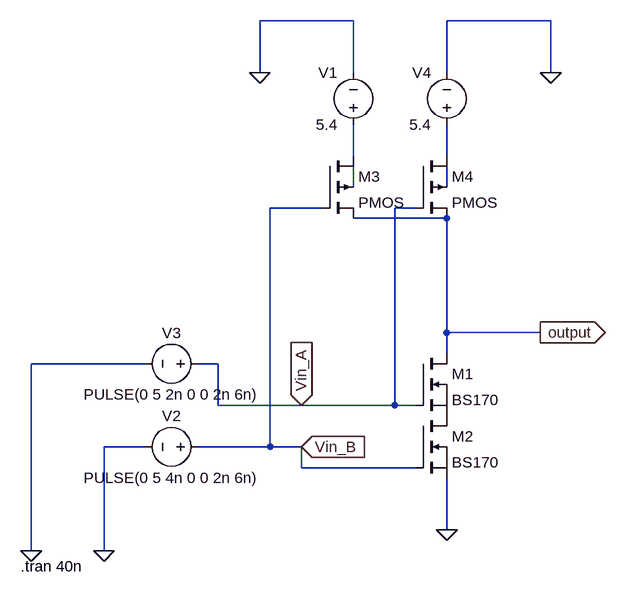
[diagram p0: schematic and_mos_v2.asc]
and_mos_v2.asc, the LTspice schematic file:
Version 4.1
SHEET 1 880 680
WIRE 80 -496 -64 -496
WIRE 384 -496 224 -496
WIRE -64 -416 -64 -496
WIRE 80 -416 80 -496
WIRE 224 -416 224 -496
WIRE 384 -416 384 -496
WIRE 80 -288 80 -336
WIRE 224 -288 224 -336
WIRE 80 -240 80 -272
WIRE 224 -240 224 -272
WIRE 32 -208 -48 -208
WIRE 176 -208 144 -208
WIRE 224 -192 80 -192
WIRE 224 -16 224 -192
WIRE 368 -16 224 -16
WIRE 224 16 224 -16
WIRE -240 32 -416 32
WIRE -128 32 -160 32
WIRE -128 96 -128 32
WIRE 0 96 -128 96
WIRE 144 96 144 -208
WIRE 144 96 0 96
WIRE 176 96 144 96
WIRE -240 160 -304 160
WIRE -48 160 -48 -208
WIRE -48 160 -160 160
WIRE 0 160 -48 160
WIRE 0 192 0 160
WIRE 176 192 0 192
WIRE 224 288 224 208
WIRE -416 320 -416 32
WIRE -304 320 -304 160
FLAG 0 96 Vin_A
IOPIN 0 96 In
FLAG 0 160 Vin_B
IOPIN 0 160 In
FLAG -304 320 0
FLAG -416 320 0
FLAG 224 288 0
FLAG 368 -16 output
IOPIN 368 -16 Out
FLAG -64 -416 0
FLAG 384 -416 0
SYMBOL voltage -144 160 R90
WINDOW 0 -32 56 VBottom 2
WINDOW 3 32 56 VTop 2
WINDOW 123 0 0 Left 0
WINDOW 39 0 0 Left 0
SYMATTR InstName V2
SYMATTR Value PULSE(0 5 4n 0 0 2n 6n)
SYMBOL voltage -144 32 R90
WINDOW 0 -32 56 VBottom 2
WINDOW 3 32 56 VTop 2
WINDOW 123 0 0 Left 0
WINDOW 39 0 0 Left 0
SYMATTR InstName V3
SYMATTR Value PULSE(0 5 2n 0 0 2n 6n)
SYMBOL nmos 176 16 R0
SYMATTR InstName M1
SYMATTR Value BS170
SYMBOL nmos 176 112 R0
SYMATTR InstName M2
SYMATTR Value BS170
SYMBOL pmos4 32 -288 R0
SYMATTR InstName M3
SYMBOL pmos4 176 -288 R0
SYMATTR InstName M4
SYMBOL voltage 80 -320 R180
WINDOW 0 24 96 Left 2
WINDOW 3 24 16 Left 2
WINDOW 123 0 0 Left 0
WINDOW 39 0 0 Left 0
SYMATTR InstName V1
SYMATTR Value 5.4
SYMBOL voltage 224 -320 R180
WINDOW 0 24 96 Left 2
WINDOW 3 24 16 Left 2
WINDOW 123 0 0 Left 0
WINDOW 39 0 0 Left 0
SYMATTR InstName V4
SYMATTR Value 5.4
TEXT -432 344 Left 2 !.tran 40n

The netlist it stands for:
* and_mos_v2.asc
V2 Vin_B 0 PULSE(0 5 4n 0 0 2n 6n)
V3 Vin_A 0 PULSE(0 5 2n 0 0 2n 6n)
M1 output Vin_A P001 P001 BS170
M2 P001 Vin_B 0 0 BS170
M3 N001 Vin_B output N003 PMOS
M4 N002 Vin_A output N004 PMOS
V1 N001 0 5.4
V4 N002 0 5.4
.model NMOS NMOS
.model PMOS PMOS
.lib standard.mos
.tran 40n
.backanno
.end

* Results of the author's LTspice run, read from the files saved beside the schematic
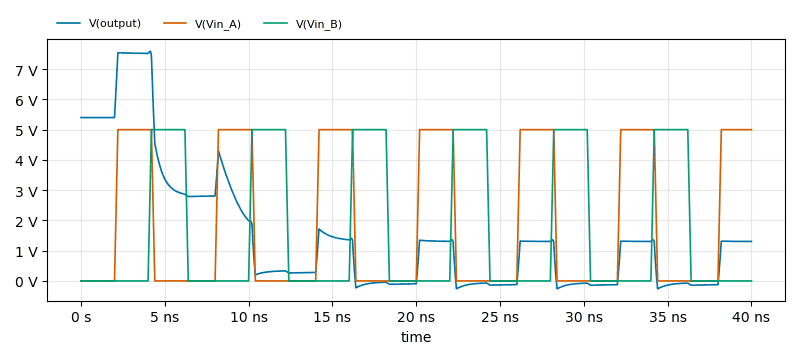
[diagram p1: Transient Analysis of and_mos_v2.asc, plotted from the saved traces]
* Transient Analysis, 1 run:
*   V(output): min -261.9 mV, max 7.592 V, average 1.485 V, rms 2.554 V, last 1.305 V
*   V(Vin_A): min 0 V, max 5 V, average 1.887 V, rms 3.029 V, last 5 V
*   V(Vin_B): min 0 V, max 5 V, average 1.65 V, rms 2.83 V, last 0 V